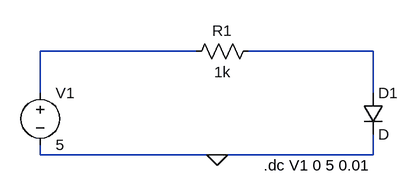
[diagram p0: schematic real_diode.asc]
real_diode.asc, the LTspice schematic file:
Version 4.1
SHEET 1 880 680
WIRE 272 64 32 64
WIRE 544 64 352 64
WIRE 32 128 32 64
WIRE 544 128 544 64
WIRE 32 224 32 208
WIRE 304 224 32 224
WIRE 544 224 544 192
WIRE 544 224 304 224
FLAG 304 224 0
SYMBOL voltage 32 112 R0
SYMATTR InstName V1
SYMATTR Value 5
SYMBOL res 368 48 R90
WINDOW 0 0 56 VBottom 2
WINDOW 3 32 56 VTop 2
SYMATTR InstName R1
SYMATTR Value 1k
SYMBOL diode 528 128 R0
SYMATTR InstName D1
TEXT 376 240 Left 2 !.dc V1 0 5 0.01

The netlist it stands for:
* real_diode.asc
V1 N001 0 5
R1 N002 N001 1k
D1 N002 0 D
.model D D
.lib standard.dio
.dc V1 0 5 0.01
.backanno
.end